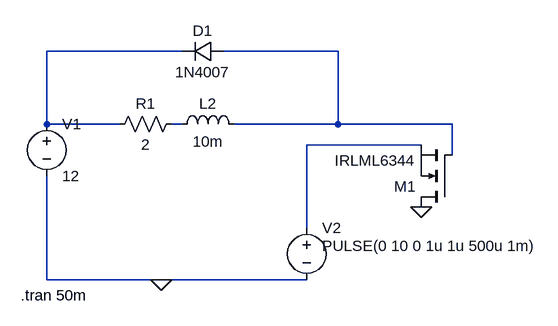
[diagram p0: schematic pwm_dc_motor.asc]
pwm_dc_motor.asc, the LTspice schematic file:
Version 4.1
SHEET 1 880 680
WIRE 288 16 80 16
WIRE 528 16 352 16
WIRE 80 128 80 16
WIRE 192 128 80 128
WIRE 288 128 272 128
WIRE 528 128 528 16
WIRE 528 128 368 128
WIRE 704 128 528 128
WIRE 656 160 480 160
WIRE 704 176 704 128
WIRE 480 288 480 160
WIRE 80 368 80 208
WIRE 256 368 80 368
WIRE 480 368 256 368
FLAG 256 368 0
FLAG 656 256 0
SYMBOL voltage 80 112 R0
WINDOW 123 0 0 Left 0
WINDOW 39 0 0 Left 0
SYMATTR InstName V1
SYMATTR Value 12
SYMBOL res 288 112 R90
WINDOW 0 0 56 VBottom 2
WINDOW 3 32 56 VTop 2
SYMATTR InstName R1
SYMATTR Value 2
SYMBOL ind 272 144 R270
WINDOW 0 32 56 VTop 2
WINDOW 3 5 56 VBottom 2
SYMATTR InstName L2
SYMATTR Value 10m
SYMATTR SpiceLine Rser=1m
SYMBOL voltage 480 272 R0
WINDOW 3 24 44 Left 2
WINDOW 123 0 0 Left 0
WINDOW 39 0 0 Left 0
SYMATTR InstName V2
SYMATTR Value PULSE(0 10 0 1u 1u 500u 1m)
SYMBOL diode 352 0 R90
WINDOW 0 0 32 VBottom 2
WINDOW 3 32 32 VTop 2
SYMATTR InstName D1
SYMATTR Value 1N4007
SYMBOL nmos 704 256 R180
SYMATTR InstName M1
SYMATTR Value IRLML6344
TEXT 40 392 Left 2 !.tran 50m

The netlist it stands for:
* pwm_dc_motor.asc
V1 N001 0 12
R1 N003 N001 2
L2 N003 N002 10m Rser=1m
V2 N004 0 PULSE(0 10 0 1u 1u 500u 1m)
D1 N002 N001 1N4007
M1 0 N002 N004 N004 IRLML6344
.model D D
.lib standard.dio
.model NMOS NMOS
.model PMOS PMOS
.lib standard.mos
.tran 50m
.backanno
.end